# Altium schematic sheet Control_Schem.SchDoc (part 1 of 5)
size A3; SheetNumber: 1; SheetTotal: 2
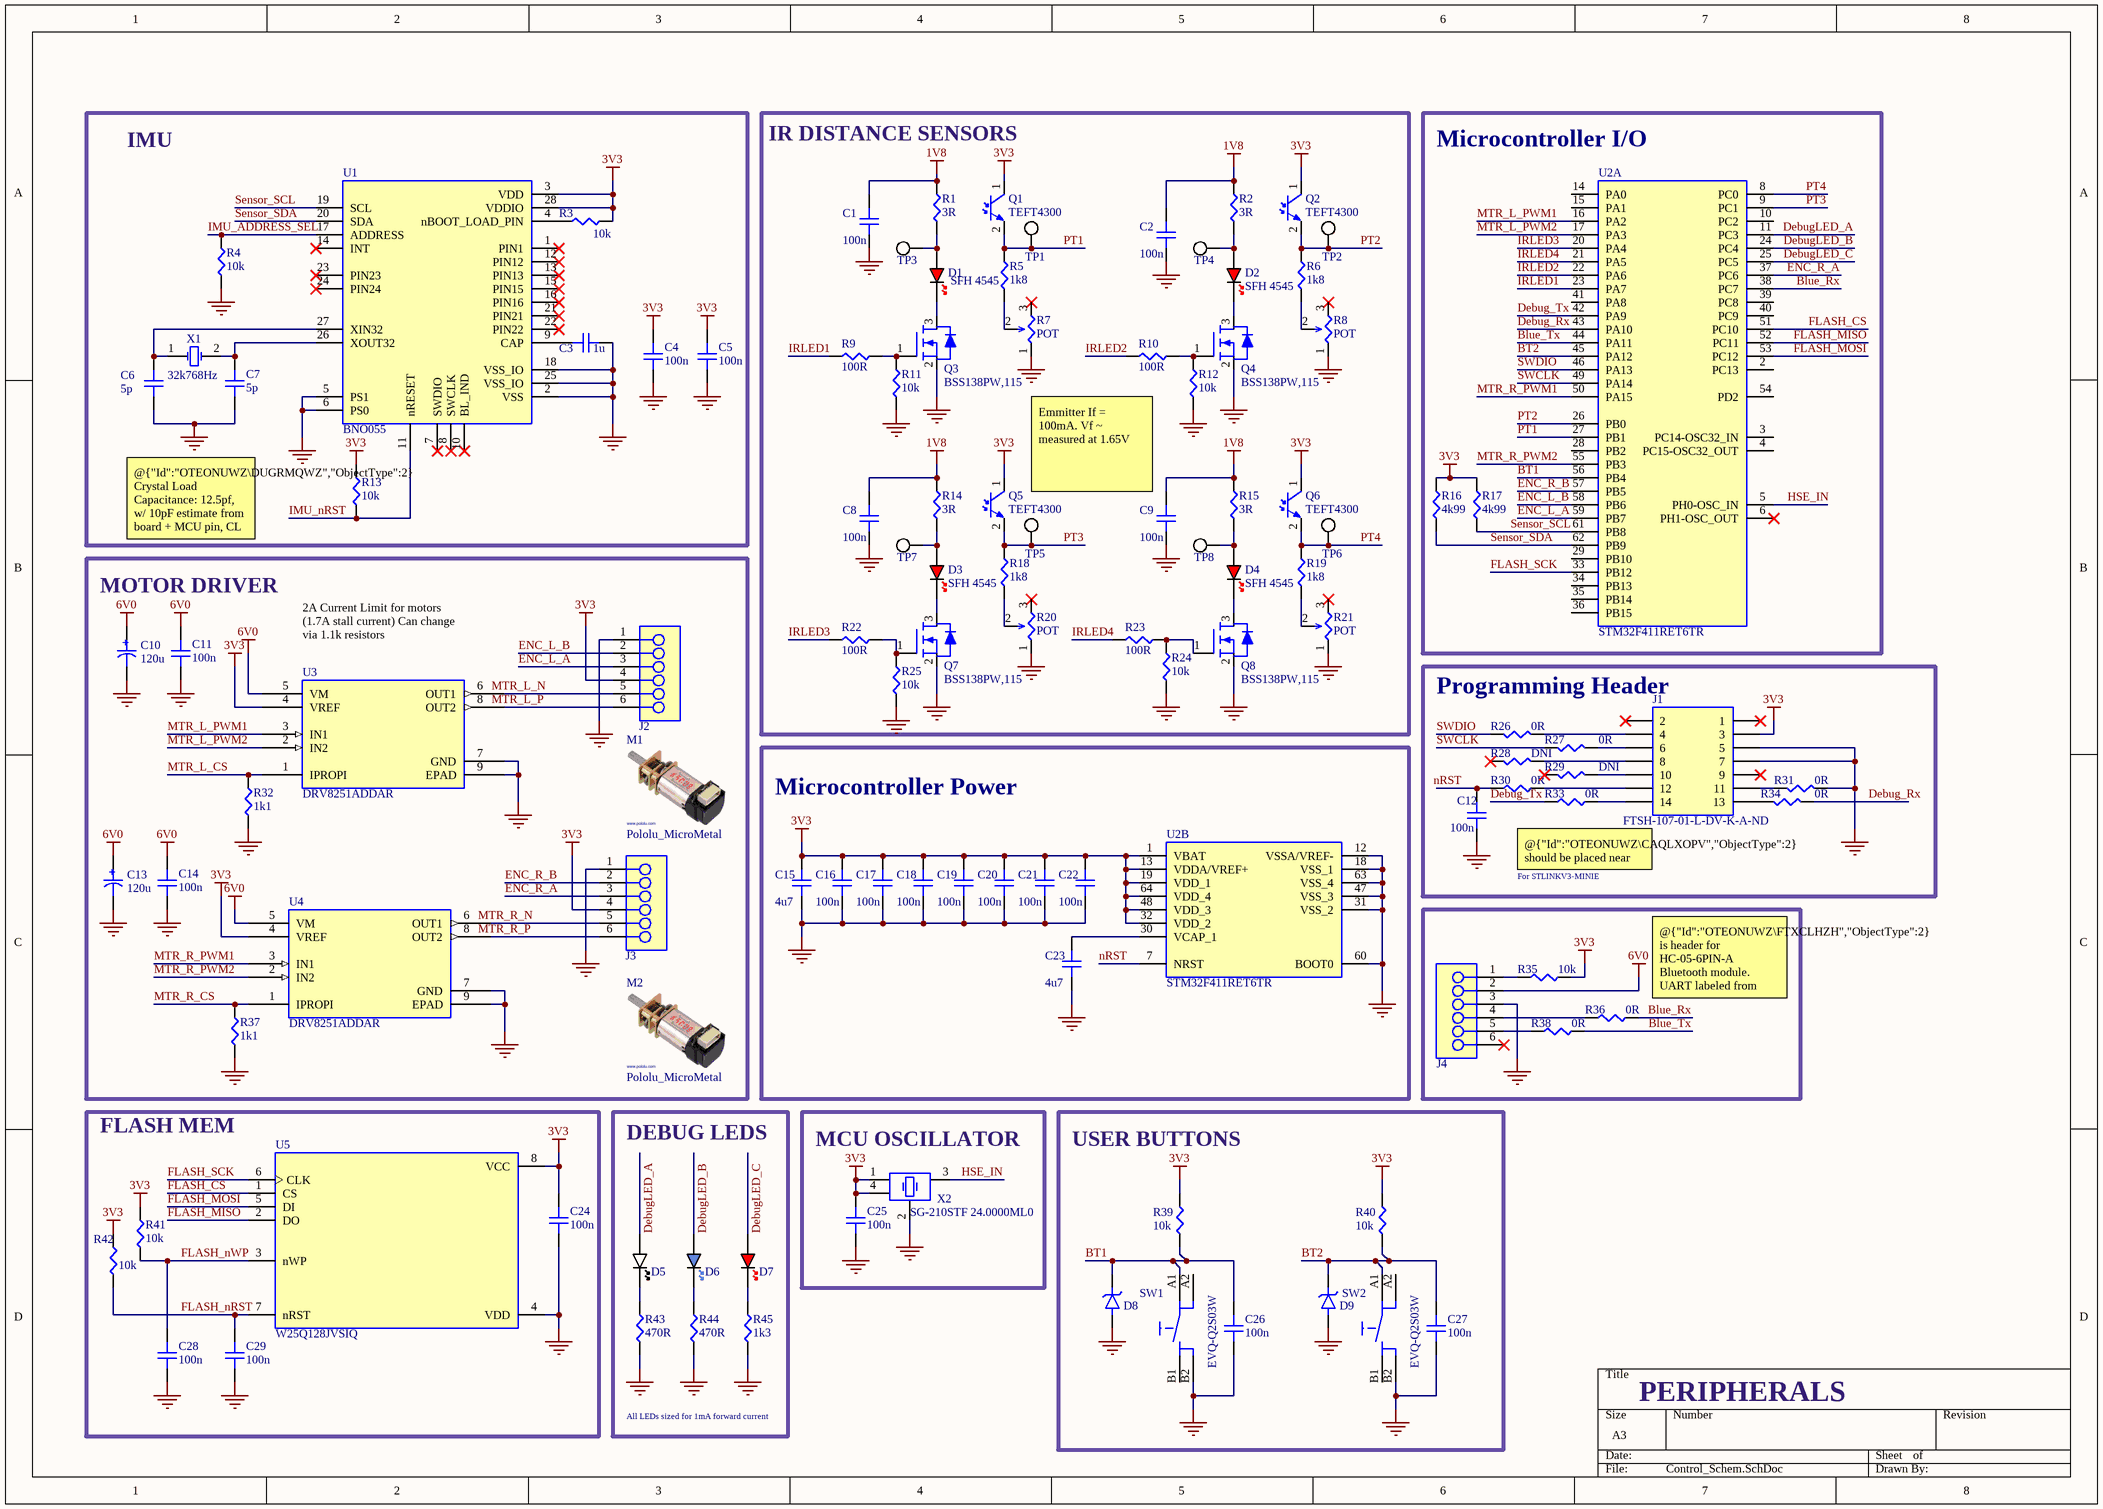
[diagram p0: Control_Schem.SchDoc]

## Parts
C1  100n  [CAP_0603]
C2  100n  [CAP_0603]
C3  1u  [CAP_0603]  (no BOM)
C4  100n  [CAP_0603]  (no BOM)
C5  100n  [CAP_0603]  (no BOM)
C6  5p  [CAP_0603]  (no BOM)
C7  5p  [CAP_0603]  (no BOM)
C8  100n  [CAP_0603]
C9  100n  [CAP_0603]
C10  120u  [PCAP_SVP_C6_PAN-M]
C11  100n  [CAP_0603]
C12  100n  [CAP_0603]
C13  120u  [PCAP_SVP_C6_PAN-M]
C14  100n  [CAP_0603]
C15  4u7  [CAP_0603]
C16  100n  [CAP_0603]
C17  100n  [CAP_0603]
C18  100n  [CAP_0603]
C19  100n  [CAP_0603]
C20  100n  [CAP_0603]
C21  100n  [CAP_0603]
C22  100n  [CAP_0603]
C23  4u7  [CAP_0603]
C24  100n  [CAP_0603]  (no BOM)
C25  100n  [CAP_0603]
C26  100n  [CAP_0603]
C27  100n  [CAP_0603]
C28  100n  [CAP_0603]  (no BOM)
C29  100n  [CAP_0603]  (no BOM)
D1  SFH 4545  [SFH4545]
D2  SFH 4545  [SFH4545]
D3  SFH 4545  [SFH4545]
D4  SFH 4545  [SFH4545]
D5  LED_White  [LED_0603]  (value not drawn)
D6  LED_Blue  [LED_0603]  (value not drawn)
D7  LED_Red  [LED_0603]  (value not drawn)
D8  65pF  [SOD-923]  (value not drawn)
D9  65pF  [SOD-923]  (value not drawn)
J1  Supplier Part Number 1: FTSH-107-01-L-DV-K-A-ND  [STM32_ProgrammingHeader]  (hidden comment: STDC14_DebugConnector)
J2  6POS  [JST_BM06B-SRSS-TB]  (value not drawn)
J3  6POS  [JST_BM06B-SRSS-TB]  (value not drawn)
J4  6POS  [P2.54_6POS]  (value not drawn)  (no BOM)
M1  Pololu_MicroMetal  [PololuMicroMetal]  (no BOM)
M2  Pololu_MicroMetal  [PololuMicroMetal]  (no BOM)
Q1  TEFT4300  [TEFT4300]
Q2  TEFT4300  [TEFT4300]
Q3  BSS138PW,115  [SOT23-3]
Q4  BSS138PW,115  [SOT23-3]
Q5  TEFT4300  [TEFT4300]
Q6  TEFT4300  [TEFT4300]
Q7  BSS138PW,115  [SOT23-3]
Q8  BSS138PW,115  [SOT23-3]
R1  3R  [RES_0603]
R2  3R  [RES_0603]
R3  10k  [RES_0603]  (no BOM)
R4  10k  [RES_0603]  (no BOM)
R5  1k8  [RES_0603]
R6  1k8  [RES_0603]
R7  POT  [TRIM_3296Y-1-203LF]
R8  POT  [TRIM_3296Y-1-203LF]
R9  100R  [RES_0603]
R10  100R  [RES_0603]
R11  10k  [RES_0603]
R12  10k  [RES_0603]
R13  10k  [RES_0603]  (no BOM)
R14  3R  [RES_0603]
R15  3R  [RES_0603]
R16  4k99  [RES_0603]
R17  4k99  [RES_0603]
R18  1k8  [RES_0603]
R19  1k8  [RES_0603]
R20  POT  [TRIM_3296Y-1-203LF]
R21  POT  [TRIM_3296Y-1-203LF]
R22  100R  [RES_0603]
R23  100R  [RES_0603]
R24  10k  [RES_0603]
R25  10k  [RES_0603]
R26  0R  [RES_0603]
R27  0R  [RES_0603]
R28  DNI  [RES_0603]  (no BOM)
R29  DNI  [RES_0603]  (no BOM)
R30  0R  [RES_0603]
R31  0R  [RES_0603]
R32  1k1  [RES_0603]
R33  0R  [RES_0603]
R34  0R  [RES_0603]
R35  10k  [RES_0603]
R36  0R  [RES_0603]
R37  1k1  [RES_0603]
R38  0R  [RES_0603]
R39  10k  [RES_0603]
R40  10k  [RES_0603]
R41  10k  [RES_0603]  (no BOM)
R42  10k  [RES_0603]  (no BOM)
R43  470R  [RES_0603]
R44  470R  [RES_0603]
R45  1k3  [RES_0603]
SW1  EVQ-Q2S03W  [EVQQ2S03W]
SW2  EVQ-Q2S03W  [EVQQ2S03W]
TP1  TP  [TP-TH]  (value not drawn)  (no BOM)
TP2  TP  [TP-TH]  (value not drawn)  (no BOM)
TP3  TP  [TP-TH]  (value not drawn)  (no BOM)
TP4  TP  [TP-TH]  (value not drawn)  (no BOM)
TP5  TP  [TP-TH]  (value not drawn)  (no BOM)
TP6  TP  [TP-TH]  (value not drawn)  (no BOM)
TP7  TP  [TP-TH]  (value not drawn)  (no BOM)
TP8  TP  [TP-TH]  (value not drawn)  (no BOM)
U1  BNO055  [LGA28_5.2X3.8]  (no BOM)
U2  STM32F411RET6TR  [LQFP-64_10X10]  (parts A,B of 2)
U3  DRV8251ADDAR  [SOIC-8_EPAD]
U4  DRV8251ADDAR  [SOIC-8_EPAD]
U5  W25Q128JVSIQ  [SOIC-8]  (no BOM)
X1  32k768Hz  [FP-ABS07-MFG]  (no BOM)
X2  SG-210STF 24.0000ML0  [OSC_4-SMD(2.5x2)]

## Blocks framed on the sheet
IMU: C3-C7 R3 R4 R13 U1 X1
IR DISTANCE SENSORS: C1 C2 C8 C9 D1-D4 Q1-Q8 R1 R2 R5-R12 R14 R15 R18-R25 TP1-TP8
Microcontroller I/O: R16 R17 U2
MOTOR DRIVER: C10 C11 C13 C14 J2 J3 M1 M2 R32 R37 U3 U4
Programming Header: C12 J1 R26-R31 R33 R34
Microcontroller Power: C15-C23 U2
FLASH MEM: C24 C28 C29 R41 R42 U5
DEBUG LEDS: D5-D7 R43-R45
MCU OSCILLATOR: C25 X2
USER BUTTONS: C26 C27 D8 D9 R39 R40 SW1 SW2

## Nets
1V8: C1.2 C2.2 C8.2 C9.2 R1.2 R2.2 R14.2 R15.2
3V3: C4.1 C5.1 C15.2 C16.2 C17.2 C18.2 C19.2 C20.2 C21.2 C22.2 C24.2 C25.2 J1.3 J2.4 J3.4 Q1.1(COLLECTOR) Q2.1(COLLECTOR) Q5.1(COLLECTOR) Q6.1(COLLECTOR) R3.1 R13.1 R16.1 R17.1 R35.2 R39.1 R40.1 R41.1 R42.1 U1.3(VDD) U1.28(VDDIO) U2.1(VBAT) U2.13(VDDA/VREF+) U2.19(VDD_1) U2.32(VDD_2) U2.48(VDD_3) U2.64(VDD_4) U3.4(VREF) U4.4(VREF) U5.8(VCC) X2.1 X2.4
6V0: C10.1 C11.1 C13.1 C14.1 J4.2 U3.5(VM) U4.5(VM)
GND: C1.1 C2.1 C3.1 C4.2 C5.2 C6.1 C7.1 C8.1 C9.1 C10.2 C11.2 C12.1 C13.2 C14.2 C15.1 C16.1 C17.1 C18.1 C19.1 C20.1 C21.1 C22.1 C23.1 C24.1 C25.1 C26.1 C27.1 C28.1 C29.1 D8.2 D9.2 J1.5 J1.7 J2.1 J3.1 J4.3 Q3.2(Source) Q4.2(Source) Q7.2(Source) Q8.2(Source) R4.2 R7.1(CCW) R8.1(CCW) R11.2 R12.2 R20.1(CCW) R21.1(CCW) R24.2 R25.2 R31.2 R32.2 R37.2 R43.2 R44.2 R45.2 SW1.B2(NO_2) SW2.B2(NO_2) U1.2(VSS) U1.5(PS1) U1.6(PS0) U1.18(VSS_IO) U1.25(VSS_IO) U2.12(VSSA/VREF-) U2.18(VSS_1) U2.31(VSS_2) U2.47(VSS_3) U2.60(BOOT0) U2.63(VSS_4) U3.7(GND) U3.9(EPAD) U4.7(GND) U4.9(EPAD) U5.4(VDD) X2.2
Blue_Rx: R36.2 U2.38(PC7)
Blue_Tx: R38.2 U2.44(PA11)
BT1: C26.2 D8.1 R39.2 SW1.A1(COM_1) U2.56(PB4)
BT2: C27.2 D9.1 R40.2 SW2.A1(COM_1) U2.45(PA12)
Debug_Rx: R34.2 U2.43(PA10)
Debug_Tx: R33.1 U2.42(PA9)
DebugLED_A: D5.2(Anode) U2.11(PC3)
DebugLED_B: D6.2(Anode) U2.24(PC4)
DebugLED_C: D7.2(Anode) U2.25(PC5)
ENC_L_A: J2.3 U2.59(PB7)
ENC_L_B: J2.2 U2.58(PB6)
ENC_R_A: J3.3 U2.37(PC6)
ENC_R_B: J3.2 U2.57(PB5)
FLASH_CS: U2.51(PC10) U5.1(CS)
FLASH_MISO: U2.52(PC11) U5.2(DO)
FLASH_MOSI: U2.53(PC12) U5.5(DI)
FLASH_nRST: C29.2 R42.2 U5.7(nRST)
FLASH_nWP: C28.2 R41.2 U5.3(nWP)
FLASH_SCK: U2.33(PB12) U5.6(CLK)
HSE_IN: U2.5(PH0-OSC_IN) X2.3
IMU_ADDRESS_SEL: R4.1 U1.17(ADDRESS)
IMU_nRST: R13.2 U1.11(nRESET)
IRLED1: R9.2 U2.23(PA7)
IRLED2: R10.2 U2.22(PA6)
IRLED3: R22.2 U2.20(PA4)
IRLED4: R23.2 U2.21(PA5)
MTR_L_CS: R32.1 U3.1(IPROPI)
MTR_L_PWM1: U2.16(PA2) U3.3(IN1)
MTR_L_PWM2: U2.17(PA3) U3.2(IN2)
MTR_R_CS: R37.1 U4.1(IPROPI)
MTR_R_PWM1: U2.50(PA15) U4.3(IN1)
MTR_R_PWM2: U2.55(PB3) U4.2(IN2)
nRST: C12.2 R30.1 U2.7(NRST)
PT1: Q1.2(EMITTER) R5.1 TP1.1 U2.27(PB1)
PT2: Q2.2(EMITTER) R6.1 TP2.1 U2.26(PB0)
PT3: Q5.2(EMITTER) R18.1 TP5.1 U2.9(PC1)
PT4: Q6.2(EMITTER) R19.1 TP6.1 U2.8(PC0)
Sensor_SCL: R17.2 U1.19(SCL) U2.61(PB8)
Sensor_SDA: R16.2 U1.20(SDA) U2.62(PB9)
SWCLK: R27.2 U2.49(PA14)
SWDIO: R26.2 U2.46(PA13)
NetC3_2: C3.2 U1.9(CAP)
NetC6_2: C6.2 U1.27(XIN32) X1.1
NetC7_2: C7.2 U1.26(XOUT32) X1.2
NetC23_2: C23.2 U2.30(VCAP_1)
NetD1_1: D1.1(Cathode) Q3.3(Drain)
NetD1_2: D1.2(Anode) R1.1 TP3.1
NetD2_1: D2.1(Cathode) Q4.3(Drain)
NetD2_2: D2.2(Anode) R2.1 TP4.1
NetD3_1: D3.1(Cathode) Q7.3(Drain)
NetD3_2: D3.2(Anode) R14.1 TP7.1
NetD4_1: D4.1(Cathode) Q8.3(Drain)
NetD4_2: D4.2(Anode) R15.1 TP8.1
NetD5_1: D5.1(Cathode) R43.1
NetD6_1: D6.1(Cathode) R44.1
NetD7_1: D7.1(Cathode) R45.1
NetJ1_4: J1.4 R26.1
NetJ1_6: J1.6 R27.1
NetJ1_8: J1.8 R28.1
NetJ1_10: J1.10 R29.1
NetJ1_11: J1.11 R31.1
NetJ1_12: J1.12 R30.2
NetJ1_13: J1.13 R34.1
NetJ1_14: J1.14 R33.2
NetJ2_5: J2.5 U3.6(OUT1)
NetJ2_6: J2.6 U3.8(OUT2)
NetJ3_5: J3.5 U4.6(OUT1)
NetJ3_6: J3.6 U4.8(OUT2)
NetJ4_1: J4.1 R35.1
NetJ4_4: J4.4 R36.1
NetJ4_5: J4.5 R38.1
NetQ3_1: Q3.1(Gate) R9.1 R11.1
NetQ4_1: Q4.1(Gate) R10.1 R12.1
NetQ7_1: Q7.1(Gate) R22.1 R25.1
NetQ8_1: Q8.1(Gate) R23.1 R24.1
NetR3_2: R3.2 U1.4(nBOOT_LOAD_PIN)
NetR5_2: R5.2 R7.2(Wiper)
NetR6_2: R6.2 R8.2(Wiper)
NetR18_2: R18.2 R20.2(Wiper)
NetR19_2: R19.2 R21.2(Wiper)

Not connected (* = marked no-connect by the designer): J1 1* 2* 9*; J4 6*; R7 3(CW)*; R8 3(CW)*; R20 3(CW)*; R21 3(CW)*; R28 2*; R29 2*; SW1 A2(COM_2) B1(NO_1); SW2 A2(COM_2) B1(NO_1); U1 1(PIN1)* 7(SWDIO)* 8(SWCLK)* 10(BL_IND)* 12(PIN12)* 13(PIN13)* 14(INT)* 15(PIN15)* 16(PIN16)* 21(PIN21)* 22(PIN22)* 23(PIN23)* 24(PIN24)*; U2 2(PC13) 3(PC14-OSC32_IN) 4(PC15-OSC32_OUT) 6(PH1-OSC_OUT)* 10(PC2) 14(PA0) 15(PA1) 28(PB2) 29(PB10) 34(PB13) 35(PB14) 36(PB15) 39(PC8) 40(PC9) 41(PA8) 54(PD2)

## Notes on the sheet
- Emmitter If = 100mA. Vf ~ measured at 1.65V
- @{"Id":"OTEONUWZ\DUGRMQWZ","ObjectType":2} Crystal Load Capacitance: 12.5pf, w/ 10pF estimate from board + MCU pin, CL = 5pF
- (near U3) 2A Current Limit for motors (1.7A stall current) Can change via 1.1k resistors
- For STLINKV3-MINIE
- @{"Id":"OTEONUWZ\CAQLXOPV","ObjectType":2} should be placed near MCU nRST pin
- (near R36) @{"Id":"OTEONUWZ\FTXCLHZH","ObjectType":2} is header for HC-05-6PIN-A Bluetooth module. UART labeled from MCU perspective.
- All LEDs sized for 1mA forward current
- PERIPHERALS
- Labels drawn without touching a wire or pin: MTR_L_N, MTR_L_P, MTR_R_N, MTR_R_P
- (in symbol CAP_ELECTROLYTIC) +

## Library data of the parts
C1 C2 C4 C5 C8 C9 C11 C12 C14 C16-C22 C25-C29 = CAP: Multi Layer Ceramic Capacitor (MLCC) / Cap Ceramic 0.1uF 50V X7R 10% Pad SMD 0603 125°C T/R; Manufacturer: Yageo Group; Manufacturer Part Number: C0603C104K5RACTU; Dissipation Factor: 2.5%; Temperature Coefficient: 30ppm/°C; Value: 100n; Supplier 1: Rutronik; Supplier: Avnet; Supplier Part Number: C0603C104K5RACTU; RoHS: Compliant; Category: Ceramic Capacitors; Stock: 848000; Pricing: 4000=0.01077, 8000=0.01035, 16000=0.00996, 32000=0.00963, 64000=0.00933 (USD); Case/Package: 0603; Case Code (Imperial): 0603; China RoHS: Compliant; Contact Plating: Tin; Country of Origin: Mexico; Depth: 800µm; Dielectric: X7R; Dielectric Material: Ceramic; Export Control Classification Number (ECCN) Code: EAR99; Height: 800µm; Harmonized Tariff Schedule (HTS) Code: 8532.24.00.20; Introduction Date: 2011-07-27; Lead Free: Lead Free; Lead Pitch: 700µm; Length: 1.6mm; Lifecycle Status: Production; Material: Ceramic; Max Operating Temperature: 125°C; Min Operating Temperature: -55°C; Mounting Technology: Surface Mount; Pins: 2; Number of Terminals: 2; Packaging: Tape & Reel; Radiation Hardening: No; REACH SVHC: Yes; Schedule B: 8532240020, 8532240020|8532240020, 8532240020|8532240020|8532240020, 8532240020|8532240020|8532240020|8532240020; Termination: SMD/SMT; Thickness: 863.6µm; Tolerance: 10%; Voltage: 50V; Voltage Rating: 50V; Voltage Rating (DC): 50V; Width: 800µm; ComponentLink1URL: https://datasheet.octopart.com:443/C0603C104K5RACTU-KEMET-datasheet-178445679.pdf?src-supplier=IHS; ComponentLink1Description: https://datasheet.octopart.com:443/C0603C104K5RACTU-KEMET-datasheet-178445679.pdf?src-supplier=IHS; ComponentLink2URL: https://datasheet.octopart.com:443/C0603C104K5RAC7867-KEMET-datasheet-184792804.pdf?src-supplier=IHS; ComponentLink2Description: https://datasheet.octopart.com:443/C0603C104K5RAC7867-KEMET-datasheet-184792804.pdf?src-supplier=IHS; ComponentLink3URL: https://datasheet.octopart.com:443/C0603C104K5RACTU-KEMET-datasheet-137357759.pdf?src-supplier=Farnell; ComponentLink3Description: https://datasheet.octopart.com:443/C0603C104K5RACTU-KEMET-datasheet-137357759.pdf?src-supplier=Farnell; ComponentLink4URL: https://datasheet.octopart.com:443/C0603C104K5RACTU-KEMET-datasheet-149521864.pdf?src-supplier=Farnell; ComponentLink4Description: https://datasheet.octopart.com:443/C0603C104K5RACTU-KEMET-datasheet-149521864.pdf?src-supplier=Farnell; ComponentLink5URL: https://datasheet.octopart.com:443/C0603C104K5RACTU-KEMET-datasheet-101575654.pdf?src-supplier=Farnell; ComponentLink5Description: https://datasheet.octopart.com:443/C0603C104K5RACTU-KEMET-datasheet-101575654.pdf?src-supplier=Farnell; ComponentLink6URL: https://datasheet.octopart.com:443/C0603C104K5RACTU-KEMET-datasheet-176142159.pdf?src-supplier=Farnell; ComponentLink6Description: https://datasheet.octopart.com:443/C0603C104K5RACTU-KEMET-datasheet-176142159.pdf?src-supplier=Farnell; ComponentLink7URL: https://datasheet.octopart.com:443/C0603C104K5RAC-TU-Kemet-datasheet-7833651.pdf?src-supplier=Farnell; ComponentLink7Description: https://datasheet.octopart.com:443/C0603C104K5RAC-TU-Kemet-datasheet-7833651.pdf?src-supplier=Farnell; ComponentLink8URL: https://datasheet.octopart.com:443/C0603C104K5RAC-TU-Kemet-datasheet-7601896.pdf?src-supplier=Farnell; ComponentLink8Description: https://datasheet.octopart.com:443/C0603C104K5RAC-TU-Kemet-datasheet-7601896.pdf?src-supplier=Farnell; ComponentLink9URL: https://datasheet.octopart.com:443/C0603C104K5RAC-TU-Kemet-datasheet-5316294.pdf?src-supplier=Farnell; ComponentLink9Description: https://datasheet.octopart.com:443/C0603C104K5RAC-TU-Kemet-datasheet-5316294.pdf?src-supplier=Farnell; ComponentLink10URL: https://datasheet.octopart.com:443/C0603C104K5RAC-TU-Kemet-datasheet-5314837.pdf?src-supplier=Farnell; ComponentLink10Description: https://datasheet.octopart.com:443/C0603C104K5RAC-TU-Kemet-datasheet-5314837.pdf?src-supplier=Farnell; ComponentLink11URL: https://datasheet.octopart.com:443/C0603C104K5RAC-TU-Kemet-datasheet-8092359.pdf?src-supplier=Farnell; ComponentLink11Description: https://datasheet.octopart.com:443/C0603C104K5RAC-TU-Kemet-datasheet-8092359.pdf?src-supplier=Farnell; ComponentLink12URL: https://datasheet.octopart.com:443/C0603C104K5RAC-TU-Kemet-datasheet-5314449.pdf?src-supplier=Farnell; ComponentLink12Description: https://datasheet.octopart.com:443/C0603C104K5RAC-TU-Kemet-datasheet-5314449.pdf?src-supplier=Farnell; ComponentLink13URL: https://datasheet.octopart.com:443/C0603C104K5RAC-TU-Kemet-datasheet-5314969.pdf?src-supplier=Farnell; ComponentLink13Description: https://datasheet.octopart.com:443/C0603C104K5RAC-TU-Kemet-datasheet-5314969.pdf?src-supplier=Farnell; ComponentLink14URL: https://datasheet.octopart.com:443/C0603C104K5RAC-TU-Kemet-datasheet-5314627.pdf?src-supplier=Farnell; ComponentLink14Description: https://datasheet.octopart.com:443/C0603C104K5RAC-TU-Kemet-datasheet-5314627.pdf?src-supplier=Farnell; ComponentLink15URL: https://datasheet.octopart.com:443/C0603C104K5RAC-TU-Kemet-datasheet-5389132.pdf?src-supplier=Farnell; ComponentLink15Description: https://datasheet.octopart.com:443/C0603C104K5RAC-TU-Kemet-datasheet-5389132.pdf?src-supplier=Farnell; ComponentLink16URL: https://datasheet.octopart.com:443/C0603C104K5RAC-TU-Kemet-datasheet-5313836.pdf?src-supplier=Farnell; ComponentLink16Description: https://datasheet.octopart.com:443/C0603C104K5RAC-TU-Kemet-datasheet-5313836.pdf?src-supplier=Farnell; ComponentLink17URL: https://datasheet.octopart.com:443/C0603C104K5RAC-TU-Kemet-datasheet-8111010.pdf?src-supplier=Farnell; ComponentLink17Description: https://datasheet.octopart.com:443/C0603C104K5RAC-TU-Kemet-datasheet-8111010.pdf?src-supplier=Farnell; ComponentLink18URL: https://datasheet.octopart.com:443/C0603C104K5RAC-TU-Kemet-datasheet-7627733.pdf?src-supplier=Farnell; ComponentLink18Description: https://datasheet.octopart.com:443/C0603C104K5RAC-TU-Kemet-datasheet-7627733.pdf?src-supplier=Farnell; ComponentLink19URL: https://datasheet.octopart.com:443/C0603C104K5RAC-TU-Kemet-datasheet-5315946.pdf?src-supplier=Farnell; ComponentLink19Description: https://datasheet.octopart.com:443/C0603C104K5RAC-TU-Kemet-datasheet-5315946.pdf?src-supplier=Farnell; ComponentLink20URL: https://datasheet.octopart.com:443/C0603C104K5RACTU-KEMET-datasheet-137357764.pdf?src-supplier=Upverter; ComponentLink20Description: https://datasheet.octopart.com:443/C0603C104K5RACTU-KEMET-datasheet-137357764.pdf?src-supplier=Upverter; ComponentLink21URL: https://datasheet.octopart.com:443/C0603C104K5RAC-TU-Kemet-datasheet-5313890.pdf?src-supplier=Newark; ComponentLink21Description: https://datasheet.octopart.com:443/C0603C104K5RAC-TU-Kemet-datasheet-5313890.pdf?src-supplier=Newark; ComponentLink22URL: https://datasheet.octopart.com:443/C0603C104K5RACTU-Kemet-datasheet-12608295.pdf?src-supplier=Newark; ComponentLink22Description: https://datasheet.octopart.com:443/C0603C104K5RACTU-Kemet-datasheet-12608295.pdf?src-supplier=Newark; ComponentLink23URL: https://datasheet.octopart.com:443/C0603C104K5RACTU-Kemet-datasheet-11992184.pdf?src-supplier=Newark; ComponentLink23Description: https://datasheet.octopart.com:443/C0603C104K5RACTU-Kemet-datasheet-11992184.pdf?src-supplier=Newark; ComponentLink24URL: https://datasheet.octopart.com:443/C0603C104K5RACTU-Kemet-datasheet-10942409.pdf?src-supplier=Newark; ComponentLink24Description: https://datasheet.octopart.com:443/C0603C104K5RACTU-Kemet-datasheet-10942409.pdf?src-supplier=Newark; ComponentLink25URL: https://datasheet.octopart.com:443/C0603C104K5RACTU-Kemet-datasheet-10404442.pdf?src-supplier=Newark; ComponentLink25Description: https://datasheet.octopart.com:443/C0603C104K5RACTU-Kemet-datasheet-10404442.pdf?src-supplier=Newark; ComponentLink26URL: https://datasheet.octopart.com:443/C0603C104K5RAC-TU-Kemet-datasheet-5390537.pdf?src-supplier=Newark; ComponentLink26Description: https://datasheet.octopart.com:443/C0603C104K5RAC-TU-Kemet-datasheet-5390537.pdf?src-supplier=Newark; ComponentLink27URL: https://datasheet.octopart.com:443/C0603C104K5RAC-TU-Kemet-datasheet-7541751.pdf?src-supplier=Newark; ComponentLink27Description: https://datasheet.octopart.com:443/C0603C104K5RAC-TU-Kemet-datasheet-7541751.pdf?src-supplier=Newark; ComponentLink28URL: https://datasheet.octopart.com:443/C0603C104K5RACTU-KEMET-datasheet-171829795.pdf?src-supplier=Newark; ComponentLink28Description: https://datasheet.octopart.com:443/C0603C104K5RACTU-KEMET-datasheet-171829795.pdf?src-supplier=Newark; ComponentLink29URL: https://datasheet.octopart.com:443/C0603C104K5RACTU-Kemet-datasheet-8764837.pdf?src-supplier=Newark; ComponentLink29Description: https://datasheet.octopart.com:443/C0603C104K5RACTU-Kemet-datasheet-8764837.pdf?src-supplier=Newark; ComponentLink30URL: https://datasheet.octopart.com:443/C0603C104K5RACTU-Kemet-datasheet-8480123.pdf?src-supplier=Newark; ComponentLink30Description: https://datasheet.octopart.com:443/C0603C104K5RACTU-Kemet-datasheet-8480123.pdf?src-supplier=Newark; ComponentLink31URL: https://datasheet.octopart.com:443/C0603C104K5RACTU-Kemet-datasheet-5393970.pdf?src-supplier=Newark; ComponentLink31Description: https://datasheet.octopart.com:443/C0603C104K5RACTU-Kemet-datasheet-5393970.pdf?src-supplier=Newark; ComponentLink32URL: https://datasheet.octopart.com:443/C0603C104K5RACTU-Kemet-datasheet-8502025.pdf?src-supplier=Newark; ComponentLink32Description: https://datasheet.octopart.com:443/C0603C104K5RACTU-Kemet-datasheet-8502025.pdf?src-supplier=Newark; ComponentLink33URL: https://datasheet.octopart.com:443/C0603C104K5RACTU-Kemet-datasheet-161801.pdf?src-supplier=Newark; ComponentLink33Description: https://datasheet.octopart.com:443/C0603C104K5RACTU-Kemet-datasheet-161801.pdf?src-supplier=Newark; ComponentLink34URL: https://datasheet.octopart.com:443/C0603C104K5RACTU-Kemet-datasheet-32036385.pdf?src-supplier=Electro+Sonic; ComponentLink34Description: https://datasheet.octopart.com:443/C0603C104K5RACTU-Kemet-datasheet-32036385.pdf?src-supplier=Electro+Sonic; ComponentLink35URL: https://datasheet.octopart.com:443/C0603C104K5RACTU-KEMET-datasheet-157246124.pdf?src-supplier=Electro+Sonic; ComponentLink35Description: https://datasheet.octopart.com:443/C0603C104K5RACTU-KEMET-datasheet-157246124.pdf?src-supplier=Electro+Sonic; ComponentLink36URL: https://datasheet.octopart.com:443/C0603C104K5RACTU-KEMET-datasheet-164512540.pdf?src-supplier=TME; ComponentLink36Description: https://datasheet.octopart.com:443/C0603C104K5RACTU-KEMET-datasheet-164512540.pdf?src-supplier=TME; ComponentLink37URL: https://datasheet.octopart.com:443/C0603C104K5RACTU-Kemet-datasheet-67830781.pdf?src-supplier=TME; ComponentLink37Description: https://datasheet.octopart.com:443/C0603C104K5RACTU-Kemet-datasheet-67830781.pdf?src-supplier=TME; ComponentLink38URL: https://datasheet.octopart.com:443/C0603C104K5RACTU-KEMET-datasheet-68331906.pdf?src-supplier=TME; ComponentLink38Description: https://datasheet.octopart.com:443/C0603C104K5RACTU-KEMET-datasheet-68331906.pdf?src-supplier=TME; ComponentLink39URL: https://datasheet.octopart.com:443/C0603C104K5RAC7867-Kemet-datasheet-62098571.pdf?src-supplier=TME; ComponentLink39Description: https://datasheet.octopart.com:443/C0603C104K5RAC7867-Kemet-datasheet-62098571.pdf?src-supplier=TME; ComponentLink40URL: https://datasheet.octopart.com:443/C0603C104K5RAC7867-Kemet-datasheet-17577222.pdf?src-supplier=TME; ComponentLink40Description: https://datasheet.octopart.com:443/C0603C104K5RAC7867-Kemet-datasheet-17577222.pdf?src-supplier=TME; ComponentLink41URL: https://datasheet.octopart.com:443/C0603C104K5RACTU-KEMET-datasheet-110724412.pdf?src-supplier=RS+(Formerly+Allied+Electronics); ComponentLink41Description: https://datasheet.octopart.com:443/C0603C104K5RACTU-KEMET-datasheet-110724412.pdf?src-supplier=RS+(Formerly+Allied+Electronics); ComponentLink42URL: https://datasheet.octopart.com:443/C0603C104K5RACTU-Kemet-datasheet-464.pdf?src-supplier=RS+(Formerly+Allied+Electronics); ComponentLink42Description: https://datasheet.octopart.com:443/C0603C104K5RACTU-Kemet-datasheet-464.pdf?src-supplier=RS+(Formerly+Allied+Electronics); ComponentLink43URL: https://datasheet.octopart.com/C0603C104K5RACTU-KEMET-datasheet-84169754.pdf; ComponentLink43Description: https://datasheet.octopart.com/C0603C104K5RACTU-KEMET-datasheet-84169754.pdf; ComponentLink44URL: https://datasheet.octopart.com:443/C0603C104K5RACTU-Kemet-datasheet-24570007.pdf?src-supplier=element14+APAC; ComponentLink44Description: https://datasheet.octopart.com:443/C0603C104K5RACTU-Kemet-datasheet-24570007.pdf?src-supplier=element14+APAC; ComponentLink45URL: https://datasheet.octopart.com:443/C0603C104K5RACTU-Kemet-datasheet-22084244.pdf?src-supplier=element14+APAC; ComponentLink45Description: https://datasheet.octopart.com:443/C0603C104K5RACTU-Kemet-datasheet-22084244.pdf?src-supplier=element14+APAC; ComponentLink46URL: https://datasheet.octopart.com:443/C0603C104K5RACTU-Kemet-datasheet-21389238.pdf?src-supplier=element14+APAC; ComponentLink46Description: https://datasheet.octopart.com:443/C0603C104K5RACTU-Kemet-datasheet-21389238.pdf?src-supplier=element14+APAC; ComponentLink47URL: https://datasheet.octopart.com:443/C0603C104K5RACTU-Kemet-datasheet-11723057.pdf?src-supplier=Arrow+Electronics; ComponentLink47Description: https://datasheet.octopart.com:443/C0603C104K5RACTU-Kemet-datasheet-11723057.pdf?src-supplier=Arrow+Electronics; ComponentLink48URL: https://datasheet.octopart.com:443/C0603C104K5RAC7867-KEMET-datasheet-164857143.pdf?src-supplier=Burklin+Elektronik; ComponentLink48Description: https://datasheet.octopart.com:443/C0603C104K5RAC7867-KEMET-datasheet-164857143.pdf?src-supplier=Burklin+Elektronik; ComponentLink49URL: https://datasheet.octopart.com:443/C0603C104K5RAC-TU-Kemet-datasheet-8187850.pdf?src-supplier=Jameco; ComponentLink49Description: https://datasheet.octopart.com:443/C0603C104K5RAC-TU-Kemet-datasheet-8187850.pdf?src-supplier=Jameco; ComponentLink50URL: https://datasheet.octopart.com:443/C0603C104K5RACTU-Kemet-datasheet-122295.pdf?src-supplier=DigiKey; ComponentLink50Description: https://datasheet.octopart.com:443/C0603C104K5RACTU-Kemet-datasheet-122295.pdf?src-supplier=DigiKey; Case Code (Metric): 1608; ComponentLink51URL: https://datasheet.octopart.com:443/CL10B104KB8NNNC-Samsung-datasheet-165517828.pdf?src-supplier=Upverter; ComponentLink51Description: https://datasheet.octopart.com:443/CL10B104KB8NNNC-Samsung-datasheet-165517828.pdf?src-supplier=Upverter; ComponentLink52URL: https://datasheet.octopart.com:443/CL10B104KB8NNNC-Samsung-Electro-Mechanics-datasheet-116890969.pdf?src-supplier=Upverter; ComponentLink52Description: https://datasheet.octopart.com:443/CL10B104KB8NNNC-Samsung-Electro-Mechanics-datasheet-116890969.pdf?src-supplier=Upverter; ComponentLink53URL: https://datasheet.octopart.com:443/CL10B104KB8NNNC-Samsung-Electro-Mechanics-datasheet-81461840.pdf?src-supplier=Upverter; ComponentLink53Description: https://datasheet.octopart.com:443/CL10B104KB8NNNC-Samsung-Electro-Mechanics-datasheet-81461840.pdf?src-supplier=Upverter; ComponentLink54URL: https://datasheet.octopart.com:443/CL10B104KB8NNNC-Samsung-Electro-Mechanics-datasheet-181551448.pdf?src-supplier=Newark; ComponentLink54Description: https://datasheet.octopart.com:443/CL10B104KB8NNNC-Samsung-Electro-Mechanics-datasheet-181551448.pdf?src-supplier=Newark; ComponentLink55URL: https://datasheet.octopart.com:443/CL10B104KB8NNNC-Samsung-Electro-Mechanics-datasheet-181551449.pdf?src-supplier=Newark; ComponentLink55Description: https://datasheet.octopart.com:443/CL10B104KB8NNNC-Samsung-Electro-Mechanics-datasheet-181551449.pdf?src-supplier=Newark; ComponentLink56URL: https://datasheet.octopart.com/CL10B104KB8NNNC-Samsung-Electro-Mechanics-datasheet-8324245.pdf; ComponentLink56Description: https://datasheet.octopart.com/CL10B104KB8NNNC-Samsung-Electro-Mechanics-datasheet-8324245.pdf; ComponentLink57URL: https://datasheet.octopart.com/CL10B104KB8NNNC-Samsung-Electro-Mechanics-datasheet-97040617.pdf; ComponentLink57Description: https://datasheet.octopart.com/CL10B104KB8NNNC-Samsung-Electro-Mechanics-datasheet-97040617.pdf; ComponentLink58URL: https://datasheet.octopart.com/General-Multilayer-Ceramic-Capacitors-Samsung-datasheet-family-111.pdf; ComponentLink58Description: https://datasheet.octopart.com/General-Multilayer-Ceramic-Capacitors-Samsung-datasheet-family-111.pdf; ComponentLink59URL: https://datasheet.octopart.com:443/CL10B104KB8NNNC-Samsung-Electro-Mechanics-datasheet-136482302.pdf?src-supplier=Samsung+SCT; ComponentLink59Description: https://datasheet.octopart.com:443/CL10B104KB8NNNC-Samsung-Electro-Mechanics-datasheet-136482302.pdf?src-supplier=Samsung+SCT; ComponentLink60URL: https://datasheet.octopart.com:443/CL10B104KB8NNNC-Samsung-datasheet-42770373.pdf?src-supplier=Future+Electronics; ComponentLink60Description: https://datasheet.octopart.com:443/CL10B104KB8NNNC-Samsung-datasheet-42770373.pdf?src-supplier=Future+Electronics; ComponentLink61URL: https://datasheet.octopart.com:443/CL10B104KB8NNNC-Samsung-datasheet-26589154.pdf?src-supplier=Future+Electronics; ComponentLink61Description: https://datasheet.octopart.com:443/CL10B104KB8NNNC-Samsung-datasheet-26589154.pdf?src-supplier=Future+Electronics; ComponentLink62URL: https://datasheet.octopart.com:443/CL10B104KB8NNNC-Samsung-Electro-Mechanics-datasheet-149136784.pdf?src-supplier=Future+Electronics; ComponentLink62Description: https://datasheet.octopart.com:443/CL10B104KB8NNNC-Samsung-Electro-Mechanics-datasheet-149136784.pdf?src-supplier=Future+Electronics; ComponentLink63URL: https://datasheet.octopart.com:443/CL10B104KB8NNNC-Samsung-datasheet-22147433.pdf?src-supplier=TME; ComponentLink63Description: https://datasheet.octopart.com:443/CL10B104KB8NNNC-Samsung-datasheet-22147433.pdf?src-supplier=TME; ComponentLink64URL: https://datasheet.octopart.com:443/CL10B104KB8NNNC-Samsung-Electro-Mechanics-datasheet-11837008.pdf?src-supplier=Arrow+Electronics; ComponentLink64Description: https://datasheet.octopart.com:443/CL10B104KB8NNNC-Samsung-Electro-Mechanics-datasheet-11837008.pdf?src-supplier=Arrow+Electronics; ComponentLink65URL: http://sigma.octopart.com:80/rohs_certificate/General-Multilayer-Ceramic-Capacitors-Samsung-family-110.pdf?src-supplier=Compliance+Statements; ComponentLink65Description: http://sigma.octopart.com:80/rohs_certificate/General-Multilayer-Ceramic-Capacitors-Samsung-family-110.pdf?src-supplier=Compliance+Statements; ComponentLink66URL: http://sigma.octopart.com:80/rohs_statement/General-Multilayer-Ceramic-Capacitors-Samsung-family-132.pdf?src-supplier=Compliance+Statements; ComponentLink66Description: http://sigma.octopart.com:80/rohs_statement/General-Multilayer-Ceramic-Capacitors-Samsung-family-132.pdf?src-supplier=Compliance+Statements; ComponentLink67URL: http://sigma.octopart.com:80/reach_statement/General-Multilayer-Ceramic-Capacitors-Samsung-family-133.pdf?src-supplier=Compliance+Statements; ComponentLink67Description: http://sigma.octopart.com:80/reach_statement/General-Multilayer-Ceramic-Capacitors-Samsung-family-133.pdf?src-supplier=Compliance+Statements
  C1 C2 C8 C9 C12 C16-C22 C26 C27: Supplier Part Number 1: KKK21419
  C4 C5 C11 C14 C25 C28 C29: Supplier Part Number 1: KKK14272
C3 = CAP: 25V 1uF X7R 卤10% 0603 Multilayer Ceramic Capacitors MLCC - SMD/SMT ROHS; Manufacturer: Samsung Electro-Mechanics; Manufacturer Part Number: CL10B105KA8NNNC; Tolerance: 10%; Value: 1u; Supplier 1: Rutronik; Supplier Part Number 1: KKS1666; RoHS: Compliant; Category: Ceramic Capacitors; Stock: 38048000; Pricing: 4000=0.0039, 12000=0.0039, 24000=0.0039, 40000=0.0038 (USD); Case/Package: 0603; Case Code (Imperial): 0603; Case Code (Metric): 1608; China RoHS: Compliant; Contact Plating: Tin; Country of Origin: Mainland China, Philippines, South Korea; Depth: 800µm; Dielectric: X7R; Dielectric Material: Ceramic; Export Control Classification Number (ECCN) Code: EAR99; Height: 900µm; Harmonized Tariff Schedule (HTS) Code: 8532.24.00.20; Introduction Date: 2009-11-02; Length: 1.6mm; Lifecycle Status: Production; Material: Ceramic; Max Operating Temperature: 125°C; Min Operating Temperature: -55°C; Mounting Technology: Surface Mount; Number of Terminals: 2; Radiation Hardening: No; REACH SVHC: Yes; Schedule B: 8532240020, 8532240020|8532240020, 8532240020|8532240020|8532240020, 8532240020|8532240020|8532240020|8532240020; Thickness: 889µm; Voltage: 25V; Voltage Rating: 25V; Voltage Rating (DC): 25V; Width: 800µm; ComponentLink1URL: https://datasheet.octopart.com:443/CL10B105KA8NNNC-Samsung-Electro-Mechanics-datasheet-182019882.pdf?src-supplier=IHS; ComponentLink1Description: https://datasheet.octopart.com:443/CL10B105KA8NNNC-Samsung-Electro-Mechanics-datasheet-182019882.pdf?src-supplier=IHS; ComponentLink2URL: https://datasheet.octopart.com:443/CL10B105KA8NNNC-Samsung-Electro-Mechanics-datasheet-106547815.pdf?src-supplier=Upverter; ComponentLink2Description: https://datasheet.octopart.com:443/CL10B105KA8NNNC-Samsung-Electro-Mechanics-datasheet-106547815.pdf?src-supplier=Upverter; ComponentLink3URL: https://datasheet.octopart.com:443/CL10B105KA8NNNC-Samsung-Electro-Mechanics-datasheet-137699931.pdf?src-supplier=Samsung+SCT; ComponentLink3Description: https://datasheet.octopart.com:443/CL10B105KA8NNNC-Samsung-Electro-Mechanics-datasheet-137699931.pdf?src-supplier=Samsung+SCT; ComponentLink4URL: https://datasheet.octopart.com:443/CL10B105KA8NNNC-Samsung-Electro-Mechanics-datasheet-116890983.pdf?src-supplier=Future+Electronics; ComponentLink4Description: https://datasheet.octopart.com:443/CL10B105KA8NNNC-Samsung-Electro-Mechanics-datasheet-116890983.pdf?src-supplier=Future+Electronics; ComponentLink5URL: https://datasheet.octopart.com:443/CL10B105KA8NNNC-Samsung-datasheet-12527851.pdf?src-supplier=Future+Electronics; ComponentLink5Description: https://datasheet.octopart.com:443/CL10B105KA8NNNC-Samsung-datasheet-12527851.pdf?src-supplier=Future+Electronics; ComponentLink6URL: https://datasheet.octopart.com:443/CL10B105KA8NNNC-Samsung-datasheet-26669022.pdf?src-supplier=Future+Electronics; ComponentLink6Description: https://datasheet.octopart.com:443/CL10B105KA8NNNC-Samsung-datasheet-26669022.pdf?src-supplier=Future+Electronics; ComponentLink7URL: https://datasheet.octopart.com:443/CL10B105KA8NNNC-Samsung-Electro-Mechanics-datasheet-149136795.pdf?src-supplier=Future+Electronics; ComponentLink7Description: https://datasheet.octopart.com:443/CL10B105KA8NNNC-Samsung-Electro-Mechanics-datasheet-149136795.pdf?src-supplier=Future+Electronics; ComponentLink8URL: https://datasheet.octopart.com:443/CL10B105KA8NNNC-Samsung-datasheet-37081328.pdf?src-supplier=Future+Electronics; ComponentLink8Description: https://datasheet.octopart.com:443/CL10B105KA8NNNC-Samsung-datasheet-37081328.pdf?src-supplier=Future+Electronics; ComponentLink9URL: https://datasheet.octopart.com/CL10B105KA8NNNC-Samsung-Electro-Mechanics-datasheet-97040617.pdf; ComponentLink9Description: https://datasheet.octopart.com/CL10B105KA8NNNC-Samsung-Electro-Mechanics-datasheet-97040617.pdf; ComponentLink10URL: https://datasheet.octopart.com/CL10B105KA8NNNC-Samsung-Electro-Mechanics-datasheet-8324245.pdf; ComponentLink10Description: https://datasheet.octopart.com/CL10B105KA8NNNC-Samsung-Electro-Mechanics-datasheet-8324245.pdf; ComponentLink11URL: https://datasheet.octopart.com/General-Multilayer-Ceramic-Capacitors-Samsung-datasheet-family-111.pdf; ComponentLink11Description: https://datasheet.octopart.com/General-Multilayer-Ceramic-Capacitors-Samsung-datasheet-family-111.pdf; ComponentLink12URL: https://datasheet.octopart.com:443/CL10B105KA8NNNC-Samsung-datasheet-59220082.pdf?src-supplier=TME; ComponentLink12Description: https://datasheet.octopart.com:443/CL10B105KA8NNNC-Samsung-datasheet-59220082.pdf?src-supplier=TME; ComponentLink13URL: https://datasheet.octopart.com:443/CL10B105KA8NNNC-Samsung-Electro-Mechanics-datasheet-11897796.pdf?src-supplier=Arrow+Electronics; ComponentLink13Description: https://datasheet.octopart.com:443/CL10B105KA8NNNC-Samsung-Electro-Mechanics-datasheet-11897796.pdf?src-supplier=Arrow+Electronics; ComponentLink14URL: http://sigma.octopart.com:80/rohs_certificate/General-Multilayer-Ceramic-Capacitors-Samsung-family-110.pdf?src-supplier=Compliance+Statements; ComponentLink14Description: http://sigma.octopart.com:80/rohs_certificate/General-Multilayer-Ceramic-Capacitors-Samsung-family-110.pdf?src-supplier=Compliance+Statements; ComponentLink15URL: http://sigma.octopart.com:80/rohs_statement/General-Multilayer-Ceramic-Capacitors-Samsung-family-132.pdf?src-supplier=Compliance+Statements; ComponentLink15Description: http://sigma.octopart.com:80/rohs_statement/General-Multilayer-Ceramic-Capacitors-Samsung-family-132.pdf?src-supplier=Compliance+Statements; ComponentLink16URL: http://sigma.octopart.com:80/reach_statement/General-Multilayer-Ceramic-Capacitors-Samsung-family-133.pdf?src-supplier=Compliance+Statements; ComponentLink16Description: http://sigma.octopart.com:80/reach_statement/General-Multilayer-Ceramic-Capacitors-Samsung-family-133.pdf?src-supplier=Compliance+Statements
C6 C7 = CAP: 0603 5 pF 50 V ±0.25 pF Tolerance NP0 SMT Multilayer Ceramic Capacitor; Manufacturer: Yageo Group; Manufacturer Part Number: CC0402CRNPO9BN7R5; Voltage Rating: 50V; Dielectric: C0G; Temperature Coefficient: 30ppm/°C; Value: 5p; Supplier 1: Newark; Supplier Part Number: 82AK9969; RoHS: Compliant; Category: Ceramic Capacitors; Stock: 6259; Pricing: 10=0.021, 25=0.02, 50=0.019, 100=0.018, 250=0.015, 500=0.011, 1000=0.008 (USD); Case/Package: 0402; Case Code (Imperial): 0402; Case Code (Metric): 1005; China RoHS: Compliant; Dielectric Material: Ceramic; Halogen Free: Halogen Free; Height: 500µm; Lead Free: Lead Free; Length: 1mm; Lifecycle Status: Production; Max Operating Temperature: 125°C; Min Operating Temperature: -55°C; Mounting Technology: Surface Mount; Number of Terminals: 2; Packaging: Tape & Reel (TR); REACH SVHC: Yes; Schedule B: 8532240020, 8532240020|8532240020|8532240020|8532240020|8532240020; Thickness: 558.8µm; Voltage Rating (DC): 50V; Width: 500µm; ComponentLink1URL: https://datasheet.octopart.com:443/CC0402CRNPO9BN7R5-Yageo-datasheet-78855684.pdf?src-supplier=IHS; ComponentLink1Description: https://datasheet.octopart.com:443/CC0402CRNPO9BN7R5-Yageo-datasheet-78855684.pdf?src-supplier=IHS; ComponentLink2URL: https://datasheet.octopart.com:443/CC0402CRNPO9BN7R5-Yageo-datasheet-182878107.pdf?src-supplier=Farnell; ComponentLink2Description: https://datasheet.octopart.com:443/CC0402CRNPO9BN7R5-Yageo-datasheet-182878107.pdf?src-supplier=Farnell; ComponentLink3URL: https://datasheet.octopart.com:443/CC0402CRNPO9BN7R5-Yageo-datasheet-151948684.pdf?src-supplier=Newark; ComponentLink3Description: https://datasheet.octopart.com:443/CC0402CRNPO9BN7R5-Yageo-datasheet-151948684.pdf?src-supplier=Newark; ComponentLink4URL: https://datasheet.octopart.com:443/CC0402CRNPO9BN7R5-Yageo-datasheet-137875056.pdf?src-supplier=Future+Electronics; ComponentLink4Description: https://datasheet.octopart.com:443/CC0402CRNPO9BN7R5-Yageo-datasheet-137875056.pdf?src-supplier=Future+Electronics; ComponentLink5URL: https://datasheet.octopart.com:443/CC0402CRNPO9BN7R5-Yageo-datasheet-136957424.pdf?src-supplier=Future+Electronics; ComponentLink5Description: https://datasheet.octopart.com:443/CC0402CRNPO9BN7R5-Yageo-datasheet-136957424.pdf?src-supplier=Future+Electronics; ComponentLink6URL: https://datasheet.octopart.com:443/CC0402CRNPO9BN7R5-Yageo-datasheet-137700082.pdf?src-supplier=Future+Electronics; ComponentLink6Description: https://datasheet.octopart.com:443/CC0402CRNPO9BN7R5-Yageo-datasheet-137700082.pdf?src-supplier=Future+Electronics; ComponentLink7URL: https://datasheet.octopart.com:443/CC0402CRNPO9BN7R5-Yageo-datasheet-137700083.pdf?src-supplier=Future+Electronics; ComponentLink7Description: https://datasheet.octopart.com:443/CC0402CRNPO9BN7R5-Yageo-datasheet-137700083.pdf?src-supplier=Future+Electronics; ComponentLink8URL: http://sigma.octopart.com:80/rohs_statement/Yageo-company-2.pdf?src-supplier=Compliance+Statements; ComponentLink8Description: http://sigma.octopart.com:80/rohs_statement/Yageo-company-2.pdf?src-supplier=Compliance+Statements; ComponentLink9URL: http://sigma.octopart.com:80/conflict_mineral_statement/Yageo-company-3.pdf?src-supplier=Compliance+Statements; ComponentLink9Description: http://sigma.octopart.com:80/conflict_mineral_statement/Yageo-company-3.pdf?src-supplier=Compliance+Statements; Supplier Part Number 1: CC0603CRNPO9BN5R0; Composition: Ceramic; Country of Origin: Mainland China, Taiwan; Depth: 800µm; Export Control Classification Number (ECCN) Code: EAR99; Harmonized Tariff Schedule (HTS) Code: 8532.24.00.20; Introduction Date: 2016-03-10; Pins: 2; Termination: SMD/SMT; Weight: 2.012816mg; ComponentLink10URL: https://datasheet.octopart.com:443/CC0603CRNPO9BN5R0-Yageo-datasheet-159617853.pdf?src-supplier=IHS; ComponentLink10Description: https://datasheet.octopart.com:443/CC0603CRNPO9BN5R0-Yageo-datasheet-159617853.pdf?src-supplier=IHS; ComponentLink11URL: https://datasheet.octopart.com:443/CC0603CRNPO9BN5R0-Yageo-datasheet-151948684.pdf?src-supplier=element14+APAC; ComponentLink11Description: https://datasheet.octopart.com:443/CC0603CRNPO9BN5R0-Yageo-datasheet-151948684.pdf?src-supplier=element14+APAC; ComponentLink12URL: https://datasheet.octopart.com:443/CC0603CRNPO9BN5R0-Yageo-datasheet-65873193.pdf?src-supplier=element14+APAC; ComponentLink12Description: https://datasheet.octopart.com:443/CC0603CRNPO9BN5R0-Yageo-datasheet-65873193.pdf?src-supplier=element14+APAC; ComponentLink13URL: https://datasheet.octopart.com:443/CC0603CRNPO9BN5R0-Yageo-datasheet-182029513.pdf?src-supplier=Farnell; ComponentLink13Description: https://datasheet.octopart.com:443/CC0603CRNPO9BN5R0-Yageo-datasheet-182029513.pdf?src-supplier=Farnell; ComponentLink14URL: https://datasheet.octopart.com:443/CC0603CRNPO9BN5R0-Yageo-datasheet-182029511.pdf?src-supplier=Farnell; ComponentLink14Description: https://datasheet.octopart.com:443/CC0603CRNPO9BN5R0-Yageo-datasheet-182029511.pdf?src-supplier=Farnell; ComponentLink15URL: https://datasheet.octopart.com:443/CC0603CRNPO9BN5R0-Yageo-datasheet-10406438.pdf?src-supplier=Newark; ComponentLink15Description: https://datasheet.octopart.com:443/CC0603CRNPO9BN5R0-Yageo-datasheet-10406438.pdf?src-supplier=Newark; ComponentLink16URL: https://datasheet.octopart.com:443/CC0603CRNPO9BN5R0-Yageo-datasheet-137875056.pdf?src-supplier=Future+Electronics; ComponentLink16Description: https://datasheet.octopart.com:443/CC0603CRNPO9BN5R0-Yageo-datasheet-137875056.pdf?src-supplier=Future+Electronics; ComponentLink17URL: https://datasheet.octopart.com:443/CC0603CRNPO9BN5R0-Yageo-datasheet-137700082.pdf?src-supplier=Future+Electronics; ComponentLink17Description: https://datasheet.octopart.com:443/CC0603CRNPO9BN5R0-Yageo-datasheet-137700082.pdf?src-supplier=Future+Electronics; ComponentLink18URL: https://datasheet.octopart.com:443/CC0603CRNPO9BN5R0-Yageo-datasheet-78855684.pdf?src-supplier=Future+Electronics; ComponentLink18Description: https://datasheet.octopart.com:443/CC0603CRNPO9BN5R0-Yageo-datasheet-78855684.pdf?src-supplier=Future+Electronics; ComponentLink19URL: https://datasheet.octopart.com:443/CC0603CRNPO9BN5R0-Yageo-datasheet-16730043.pdf?src-supplier=Future+Electronics; ComponentLink19Description: https://datasheet.octopart.com:443/CC0603CRNPO9BN5R0-Yageo-datasheet-16730043.pdf?src-supplier=Future+Electronics; ComponentLink20URL: https://datasheet.octopart.com:443/CC0603CRNPO9BN5R0-Yageo-datasheet-12589826.pdf?src-supplier=Future+Electronics; ComponentLink20Description: https://datasheet.octopart.com:443/CC0603CRNPO9BN5R0-Yageo-datasheet-12589826.pdf?src-supplier=Future+Electronics; ComponentLink21URL: https://datasheet.octopart.com:443/CC0603CRNPO9BN5R0-Yageo-datasheet-8817079.pdf?src-supplier=Future+Electronics; ComponentLink21Description: https://datasheet.octopart.com:443/CC0603CRNPO9BN5R0-Yageo-datasheet-8817079.pdf?src-supplier=Future+Electronics; ComponentLink22URL: https://datasheet.octopart.com:443/CC0603CRNPO9BN5R0-Yageo-datasheet-8324240.pdf?src-supplier=Future+Electronics; ComponentLink22Description: https://datasheet.octopart.com:443/CC0603CRNPO9BN5R0-Yageo-datasheet-8324240.pdf?src-supplier=Future+Electronics; ComponentLink23URL: https://datasheet.octopart.com:443/CC0603CRNPO9BN5R0-Yageo-datasheet-504625.pdf?src-supplier=Future+Electronics; ComponentLink23Description: https://datasheet.octopart.com:443/CC0603CRNPO9BN5R0-Yageo-datasheet-504625.pdf?src-supplier=Future+Electronics; ComponentLink24URL: https://datasheet.octopart.com:443/CC0603CRNPO9BN5R0-Yageo-datasheet-5321569.pdf?src-supplier=Future+Electronics; ComponentLink24Description: https://datasheet.octopart.com:443/CC0603CRNPO9BN5R0-Yageo-datasheet-5321569.pdf?src-supplier=Future+Electronics
C10 C13 = CAP_ELECTROLYTIC: Cap Aluminum Polymer 120uF 20VDC 20%( 6.3 X 5.9mm) SMD 0.025 Ohm 3.2A 5000h 105C T/R; Manufacturer: Panasonic; Manufacturer Part Number: 20SVPF120M; Manufacturer Lifecycle Status: ACTIVE; Part Series: SVPF; Dissipation Factor: 12%; ESR (Equivalent Series Resistance): 25mΩ; Leakage Current: 480µA; Life (Hours): 5000hours; Polarity: Polar; Ripple Current: 160mA; Voltage: 20V; Value: 120u; Supplier: Avnet; Supplier Part Number: 20SVPF120M; RoHS: Compliant; Category: Aluminum Electrolytic Capacitors; Stock: 9000; Pricing: 1000=0.41678, 2000=0.40686, 4000=0.39799, 8000=0.39059, 16000=0.38429 (USD); Case/Package: Radial; Country of Origin: Japan; Diameter: 6.3mm; Export Control Classification Number (ECCN) Code: EAR99; Height: 5.9mm; Height - Seated (Max): 5.9944mm; Introduction Date: 2010-04-12; Lead Free: Lead Free; Length: 6.6mm; Lifecycle Status: Production; Material: Polymer; Max Operating Temperature: 105°C; Min Operating Temperature: -55°C; Mounting Technology: Surface Mount; Pins: 6; Number of Terminals: 2; Radiation Hardening: No; REACH SVHC: Yes; Ripple Current (AC): 3.2A; Schedule B: 8532220020, 8532220020|8532220020, 8532220020|8532220020|8532220020, 8532220020|8532220020|8532220020|8532220020; Termination: SMD/SMT; Tolerance: 20%; Voltage Rating: 20V; Voltage Rating (DC): 20V; Width: 6.6mm; ComponentLink1URL: https://datasheet.octopart.com:443/20SVPF120M-Panasonic-datasheet-182100667.pdf?src-supplier=IHS; ComponentLink1Description: https://datasheet.octopart.com:443/20SVPF120M-Panasonic-datasheet-182100667.pdf?src-supplier=IHS; ComponentLink2URL: https://datasheet.octopart.com:443/20SVPF120M-Panasonic-datasheet-61627574.pdf?src-supplier=Panasonic; ComponentLink2Description: https://datasheet.octopart.com:443/20SVPF120M-Panasonic-datasheet-61627574.pdf?src-supplier=Panasonic; ComponentLink3URL: https://datasheet.octopart.com:443/20SVPF120M-Panasonic-datasheet-137287092.pdf?src-supplier=TME; ComponentLink3Description: https://datasheet.octopart.com:443/20SVPF120M-Panasonic-datasheet-137287092.pdf?src-supplier=TME; ComponentLink4URL: https://datasheet.octopart.com:443/20SVPF120M-Panasonic-datasheet-154766060.pdf?src-supplier=Master+Electronics; ComponentLink4Description: https://datasheet.octopart.com:443/20SVPF120M-Panasonic-datasheet-154766060.pdf?src-supplier=Master+Electronics; ComponentLink5URL: https://datasheet.octopart.com:443/20SVPF120M-Panasonic-datasheet-17932128.pdf?src-supplier=Newark; ComponentLink5Description: https://datasheet.octopart.com:443/20SVPF120M-Panasonic-datasheet-17932128.pdf?src-supplier=Newark; ComponentLink6URL: https://sigma.octopart.com:443/150570690/technical_drawing/Panasonic-20SVPF120M.pdf?src-supplier=Panasonic+SCT; ComponentLink6Description: https://sigma.octopart.com:443/150570690/technical_drawing/Panasonic-20SVPF120M.pdf?src-supplier=Panasonic+SCT; ComponentLink7URL: https://datasheet.octopart.com:443/20SVPF120M-Panasonic-datasheet-17853225.pdf?src-supplier=Farnell; ComponentLink7Description: https://datasheet.octopart.com:443/20SVPF120M-Panasonic-datasheet-17853225.pdf?src-supplier=Farnell; ComponentLink8URL: https://datasheet.octopart.com:443/20SVPF120M-Panasonic-datasheet-23711707.pdf?src-supplier=Electro+Sonic; ComponentLink8Description: https://datasheet.octopart.com:443/20SVPF120M-Panasonic-datasheet-23711707.pdf?src-supplier=Electro+Sonic; ComponentLink9URL: https://datasheet.octopart.com:443/20SVPF120M-Panasonic-datasheet-13692623.pdf?src-supplier=Future+Electronics; ComponentLink9Description: https://datasheet.octopart.com:443/20SVPF120M-Panasonic-datasheet-13692623.pdf?src-supplier=Future+Electronics; ComponentLink10URL: https://datasheet.octopart.com:443/20SVPF120M-Panasonic-datasheet-41466111.pdf?src-supplier=RS+(Formerly+Allied+Electronics); ComponentLink10Description: https://datasheet.octopart.com:443/20SVPF120M-Panasonic-datasheet-41466111.pdf?src-supplier=RS+(Formerly+Allied+Electronics); Supplier 1: Avnet; Supplier Part Number 1: 20SVPF120M; ComponentLink11URL: https://datasheet.octopart.com:443/20SVPF120M-Sanyo-datasheet-182101940.pdf?src-supplier=IHS; ComponentLink11Description: https://datasheet.octopart.com:443/20SVPF120M-Sanyo-datasheet-182101940.pdf?src-supplier=IHS; ComponentLink12URL: https://datasheet.octopart.com/20SVPF120M-Panasonic-datasheet-13692623.pdf; ComponentLink12Description: https://datasheet.octopart.com/20SVPF120M-Panasonic-datasheet-13692623.pdf
C15 C23 = CAP: 25V 4.7uF X6S ±10% 0603 Multilayer Ceramic Capacitors MLCC - SMD/SMT ROHS; Manufacturer: Murata; Manufacturer Part Number: GRT188C81E475KE13D; Manufacturer Lifecycle Status: IN PRODUCTION; Value: 4u7; Supplier 1: Avnet; Supplier Part Number 1: GRT188C81E475KE13D; RoHS: Compliant; Category: Ceramic Capacitors; Stock: 460000; Pricing: 4000=0.02432, 8000=0.024, 16000=0.02338, 32000=0.02308, 64000=0.02285 (USD); Case/Package: 0603; Case Code (Imperial): 0603; Case Code (Metric): 1608; Dielectric: X6S; Dielectric Material: Ceramic; Export Control Classification Number (ECCN) Code: EAR99; Height: 800µm; Harmonized Tariff Schedule (HTS) Code: 8532.24.00.20; Introduction Date: 2016-01-27; Length: 1.6mm; Lifecycle Status: Production; Material: Ceramic; Max Operating Temperature: 105°C; Min Operating Temperature: -55°C; Mounting Technology: Surface Mount; Number of Terminals: 2; Packaging: Cut Tape; Ratings: AEC-Q200; REACH SVHC: Yes; Schedule B: 8532240020, 8532240020|8532240020, 8532240020|8532240020|8532240020, 8532240020|8532240020|8532240020|8532240020; Tolerance: 10%; Voltage Rating: 25V; Voltage Rating (DC): 25V; Width: 800µm; ComponentLink1URL: https://datasheet.octopart.com:443/GRT188C81E475KE13D-Murata-datasheet-149523579.pdf?src-supplier=Farnell; ComponentLink1Description: https://datasheet.octopart.com:443/GRT188C81E475KE13D-Murata-datasheet-149523579.pdf?src-supplier=Farnell; ComponentLink2URL: https://datasheet.octopart.com:443/GRT188C81E475KE13D-Murata-datasheet-67697744.pdf?src-supplier=Newark; ComponentLink2Description: https://datasheet.octopart.com:443/GRT188C81E475KE13D-Murata-datasheet-67697744.pdf?src-supplier=Newark; ComponentLink3URL: https://datasheet.octopart.com:443/GRT188C81E475KE13D-Murata-datasheet-141284540.pdf?src-supplier=Geoflip; ComponentLink3Description: https://datasheet.octopart.com:443/GRT188C81E475KE13D-Murata-datasheet-141284540.pdf?src-supplier=Geoflip; ComponentLink4URL: https://datasheet.octopart.com:443/GRT188C81E475KE13D-Murata-datasheet-165579666.pdf?src-supplier=TME; ComponentLink4Description: https://datasheet.octopart.com:443/GRT188C81E475KE13D-Murata-datasheet-165579666.pdf?src-supplier=TME; ComponentLink5URL: https://datasheet.octopart.com:443/GRT188C81E475KE13D-Murata-datasheet-140711288.pdf?src-supplier=Ciiva; ComponentLink5Description: https://datasheet.octopart.com:443/GRT188C81E475KE13D-Murata-datasheet-140711288.pdf?src-supplier=Ciiva; ComponentLink6URL: https://datasheet.octopart.com:443/GRT188C81E475KE13D-Murata-datasheet-138749062.pdf?src-supplier=Ciiva; ComponentLink6Description: https://datasheet.octopart.com:443/GRT188C81E475KE13D-Murata-datasheet-138749062.pdf?src-supplier=Ciiva; ComponentLink7URL: http://sigma.octopart.com:80/reach_statement/Murata-company-16.pdf?src-supplier=Compliance+Statements; ComponentLink7Description: http://sigma.octopart.com:80/reach_statement/Murata-company-16.pdf?src-supplier=Compliance+Statements